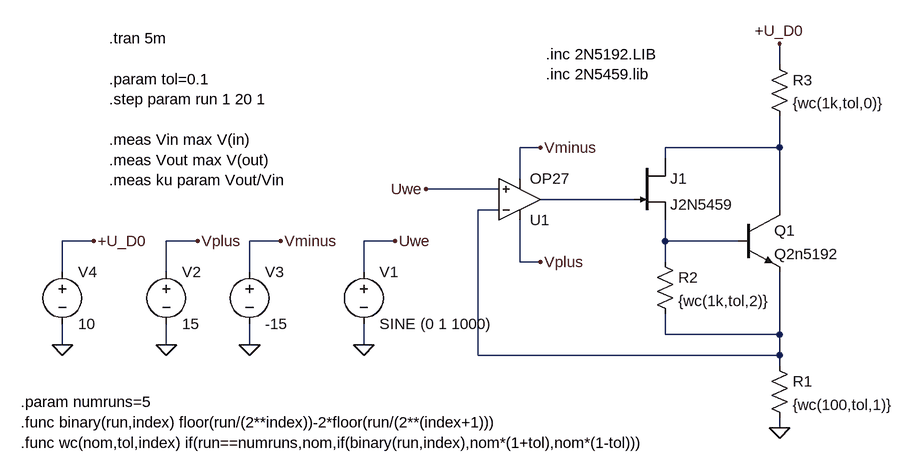
[diagram p0: schematic 35b.asc]
35b.asc, the LTspice schematic file:
Version 4
SHEET 1 1328 680
WIRE 1120 -128 1120 -160
WIRE 752 0 720 0
WIRE 1120 0 1120 -48
WIRE 1120 0 944 0
WIRE 944 16 944 0
WIRE 720 48 720 0
WIRE 688 64 576 64
WIRE 896 80 752 80
WIRE 688 96 656 96
WIRE 1120 96 1120 0
WIRE 64 144 16 144
WIRE 224 144 176 144
WIRE 352 144 304 144
WIRE 528 144 480 144
WIRE 944 144 944 112
WIRE 1056 144 944 144
WIRE 720 176 720 112
WIRE 752 176 720 176
WIRE 944 176 944 144
WIRE 16 192 16 144
WIRE 176 192 176 144
WIRE 304 192 304 144
WIRE 480 192 480 144
WIRE 944 288 944 256
WIRE 1120 288 1120 192
WIRE 1120 288 944 288
WIRE 16 304 16 272
WIRE 176 304 176 272
WIRE 304 304 304 272
WIRE 480 304 480 272
WIRE 656 320 656 96
WIRE 1120 320 1120 288
WIRE 1120 320 656 320
WIRE 1120 336 1120 320
WIRE 1120 432 1120 416
FLAG 176 304 0
FLAG 304 304 0
FLAG 480 304 0
FLAG 224 144 Vplus
FLAG 352 144 Vminus
FLAG 752 176 Vplus
FLAG 752 0 Vminus
FLAG 1120 432 0
FLAG 528 144 Uwe
FLAG 1120 -160 +U_D0
FLAG 576 64 Uwe
FLAG 16 304 0
FLAG 64 144 +U_D0
SYMBOL voltage 176 176 R0
SYMATTR InstName V2
SYMATTR Value 15
SYMBOL voltage 304 176 R0
SYMATTR InstName V3
SYMATTR Value -15
SYMBOL voltage 480 176 R0
SYMATTR InstName V1
SYMATTR Value SINE (0 1 1000)
SYMBOL OpAmps\\OP27 720 144 M180
SYMATTR InstName U1
SYMBOL res 1104 320 R0
SYMATTR InstName R1
SYMATTR Value {wc(100,tol,1)}
SYMBOL res 928 160 R0
SYMATTR InstName R2
SYMATTR Value {wc(1k,tol,2)}
SYMBOL res 1104 -144 R0
SYMATTR InstName R3
SYMATTR Value {wc(1k,tol,0)}
SYMBOL voltage 16 176 R0
SYMATTR InstName V4
SYMATTR Value 10
SYMBOL njf 896 16 R0
SYMATTR InstName J1
SYMATTR Value J2N5459
SYMBOL npn 1056 96 R0
SYMATTR InstName Q1
SYMATTR Value Q2n5192
TEXT 760 -144 Left 2 !.inc 2N5192.LIB\n.inc 2N5459.lib
TEXT 88 -168 Left 2 !.tran 5m\n \n.param tol=0.1\n.step param run 1 20 1\n \n.meas Vin max V(in)\n.meas Vout max V(out)\n.meas ku param Vout/Vin
TEXT -48 392 Left 2 !.param numruns=5\n.func binary(run,index) floor(run/(2**index))-2*floor(run/(2**(index+1)))\n.func wc(nom,tol,index) if(run==numruns,nom,if(binary(run,index),nom*(1+tol),nom*(1-tol)))

The netlist it stands for:
* 35b.asc
V2 Vplus 0 15
V3 Vminus 0 -15
V1 Uwe 0 SINE (0 1 1000)
XU1 Uwe N003 Vplus Vminus N002 OP27  ; pins In+ In- V+ V- OUT
R1 N003 0 {wc(100,tol,1)}
R2 N004 N003 {wc(1k,tol,2)}
R3 +U_D0 N001 {wc(1k,tol,0)}
V4 +U_D0 0 10
J1 N001 N002 N004 J2N5459
Q1 N001 N004 N003 0 Q2n5192
.model NPN NPN
.model PNP PNP
.lib standard.bjt
.model NJF NJF
.model PJF PJF
.lib standard.jft
.inc 2N5192.LIB
.inc 2N5459.lib
.tran 5m
.param tol=0.1
.step param run 1 20 1
.meas Vin max V(in)
.meas Vout max V(out)
.meas ku param Vout/Vin
.param numruns=5
.func binary(run,index) floor(run/(2**index))-2*floor(run/(2**(index+1)))
.func wc(nom,tol,index) if(run==numruns,nom,if(binary(run,index),nom*(1+tol),nom*(1-tol)))
.lib ADI.lib
.backanno
.end